# Altium schematic sheet AnchorBoard_SNS_Edison.SchDoc
size A3; Date: 10.04.2016; Author: bunto1; DrawnBy: bunto1; Organization: BFH; Address1: Berner Fachhochschule; Address2: Technik und Informatik; Address3: Höheweg 80; Address4: 2501 Biel/Bienne; DocumentNumber: 1; Revision: 1.1; SheetNumber: 2; SheetTotal: 2; CurrentDate: 10.04.2016
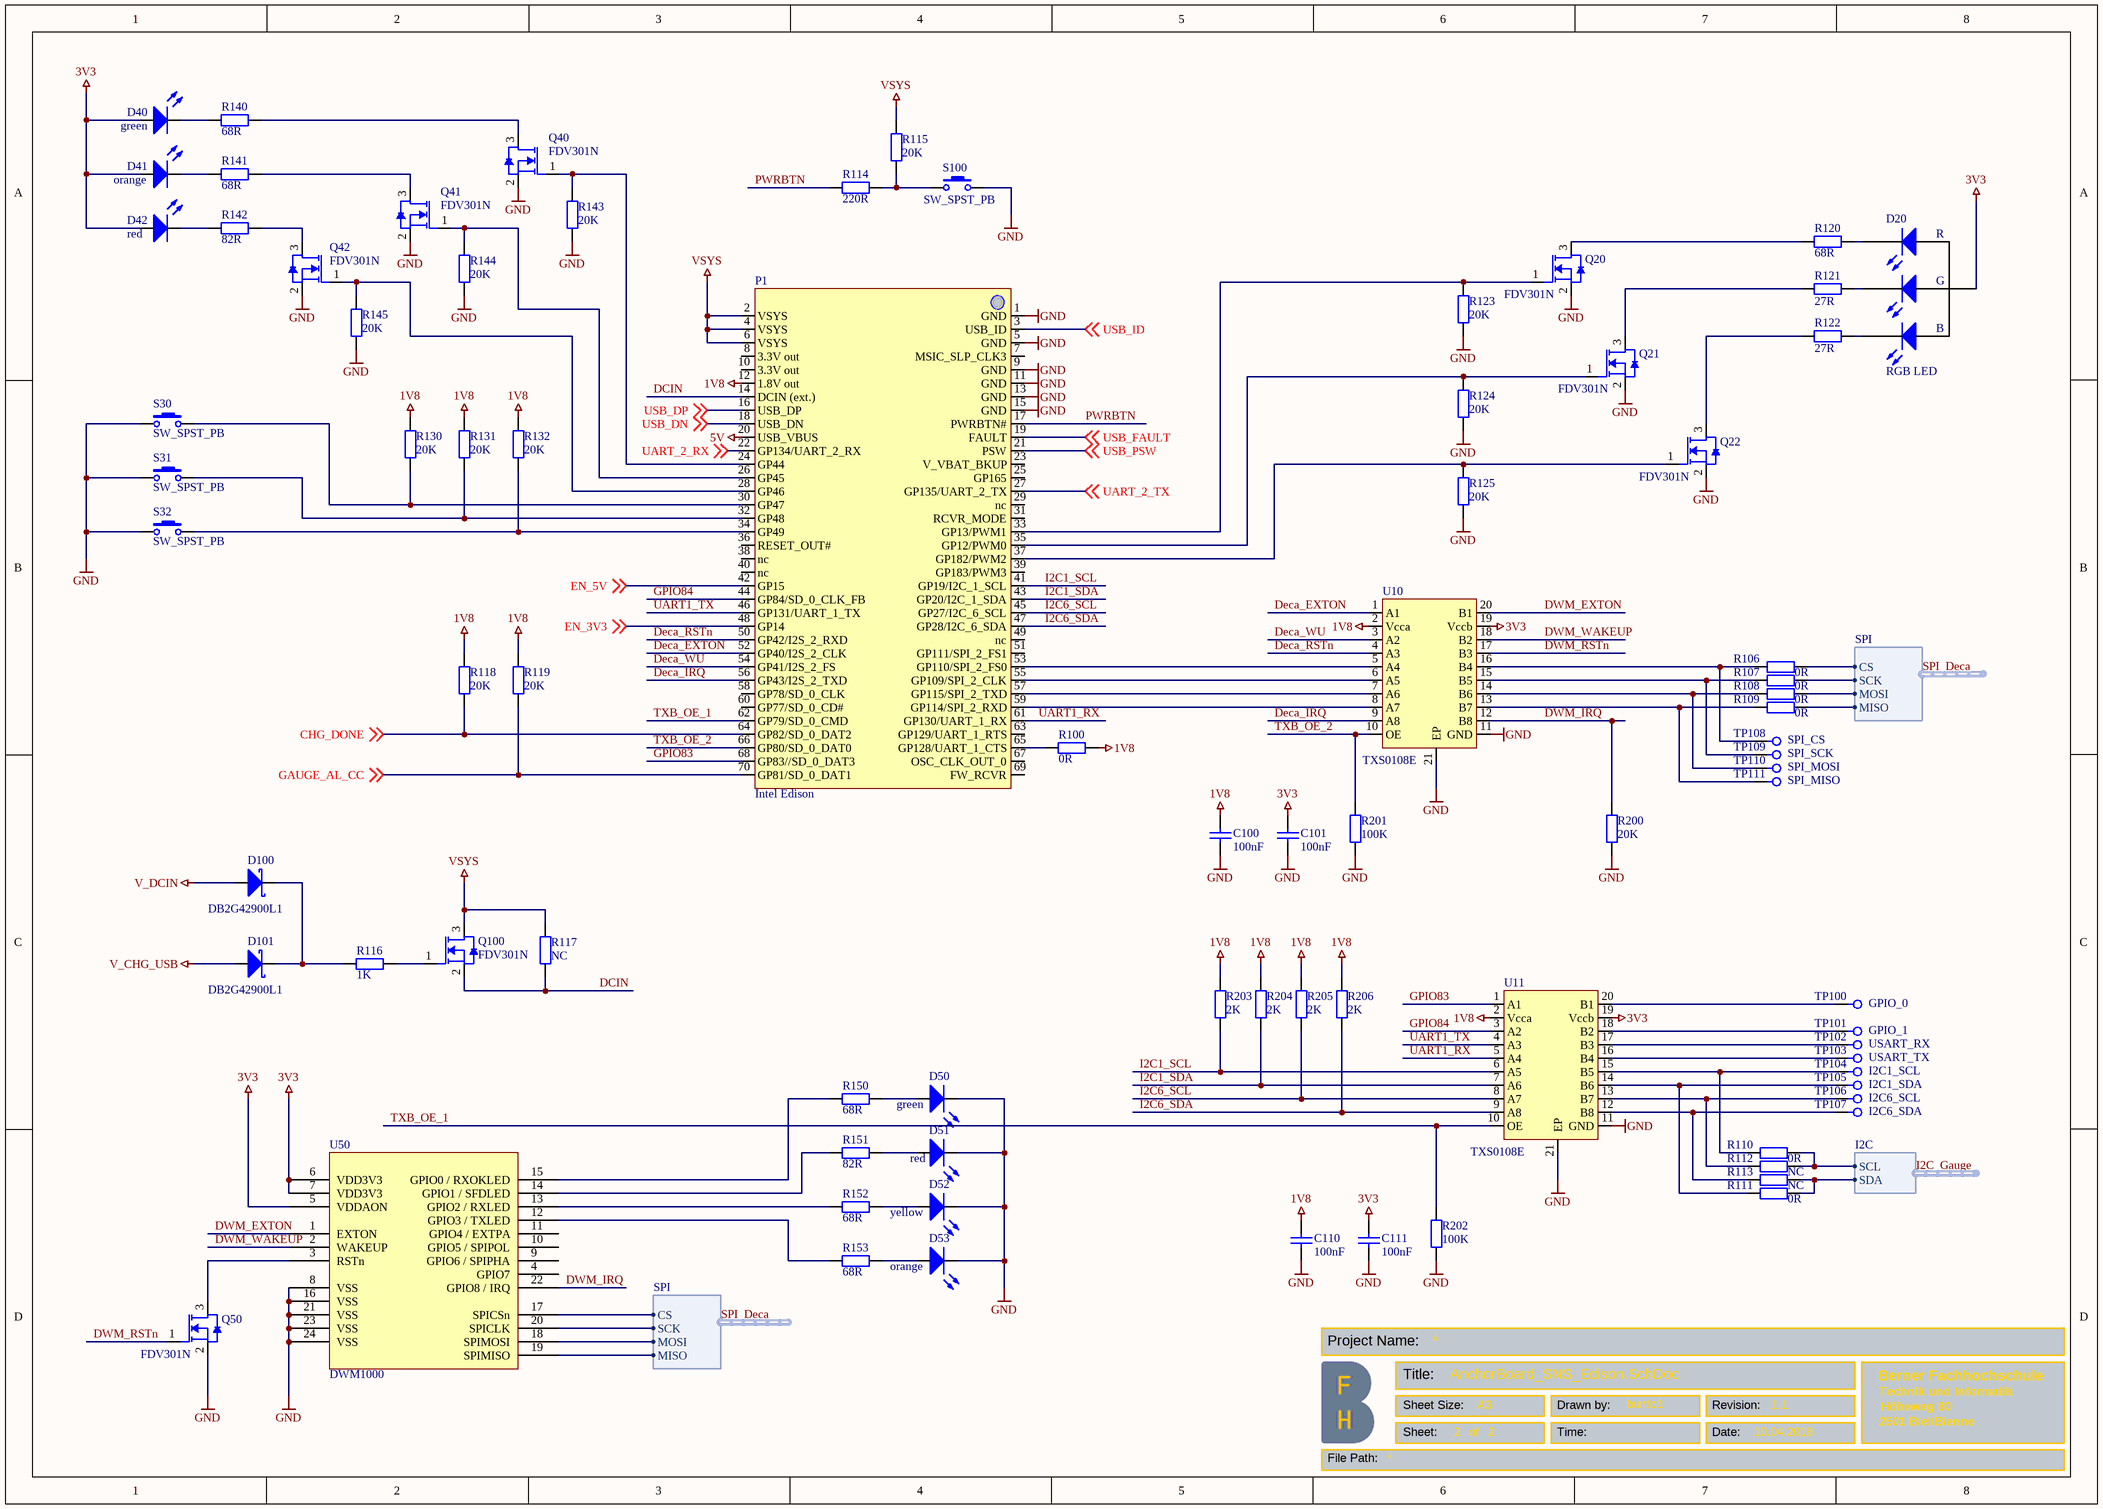
[diagram p0: AnchorBoard_SNS_Edison.SchDoc]

## Parts
C100  100nF  [CAPC1005X50]
C101  100nF  [CAPC1005X50]
C110  100nF  [CAPC1005X50]
C111  100nF  [CAPC1005X50]
D20  RGB LED  [PLCC160P350X280X190-4]
D40  green  [LEDM1608X80]
D41  orange  [LEDM1608X80]
D42  red  [LEDM1608X80]
D50  green  [LEDM1608X80]
D51  red  [LEDM1608X80]
D52  yellow  [LEDM1608X80]
D53  orange  [LEDM1608X80]
D100  DB2G42900L1  [DIOC1006X10]
D101  DB2G42900L1  [DIOC1006X10]
P1  Intel Edison  [HDRV70W12P40_2X35_Edison]
Q20  FDV301N  [SOT190P360X120-3]
Q21  FDV301N  [SOT190P360X120-3]
Q22  FDV301N  [SOT190P360X120-3]
Q40  FDV301N  [SOT190P360X120-3]
Q41  FDV301N  [SOT190P360X120-3]
Q42  FDV301N  [SOT190P360X120-3]
Q50  FDV301N  [SOT190P360X120-3]
Q100  FDV301N  [SOT190P360X120-3]
R100  0R  [RESC1005X35]
R106  0R  [RESC1005X35]
R107  0R  [RESC1005X35]
R108  0R  [RESC1005X35]
R109  0R  [RESC1005X35]
R110  0R  [RESC1005X35]
R111  0R  [RESC1005X35]
R112  NC  [RESC1005X35]
R113  NC  [RESC1005X35]
R114  220R  [RESC1005X35]
R115  20K  [RESC1005X35]
R116  1K  [RESC1005X35]
R117  NC  [RESC1005X35]
R118  20K  [RESC1005X35]
R119  20K  [RESC1005X35]
R120  68R  [RESC1005X35]
R121  27R  [RESC1005X35]
R122  27R  [RESC1005X35]
R123  20K  [RESC1005X35]
R124  20K  [RESC1005X35]
R125  20K  [RESC1005X35]
R130  20K  [RESC1005X35]
R131  20K  [RESC1005X35]
R132  20K  [RESC1005X35]
R140  68R  [RESC1005X35]
R141  68R  [RESC1005X35]
R142  82R  [RESC1005X35]
R143  20K  [RESC1005X35]
R144  20K  [RESC1005X35]
R145  20K  [RESC1005X35]
R150  68R  [RESC1005X35]
R151  82R  [RESC1005X35]
R152  68R  [RESC1005X35]
R153  68R  [RESC1005X35]
R200  20K  [RESC1005X35]
R201  100K  [RESC1005X35]
R202  100K  [RESC1005X35]
R203  2K  [RESC1005X35]
R204  2K  [RESC1005X35]
R205  2K  [RESC1005X35]
R206  2K  [RESC1005X35]
S30  SW_SPST_PB  [SW_7914J-1-000E]
S31  SW_SPST_PB  [SW_7914J-1-000E]
S32  SW_SPST_PB  [SW_7914J-1-000E]
S100  SW_SPST_PB  [SW_7914J-1-000E]
TP100  GPIO_0  [TP_THT]
TP101  GPIO_1  [TP_THT]
TP102  USART_RX  [TP_THT]
TP103  USART_TX  [TP_THT]
TP104  I2C1_SCL  [TP_THT]
TP105  I2C1_SDA  [TP_THT]
TP106  I2C6_SCL  [TP_THT]
TP107  I2C6_SDA  [TP_THT]
TP108  SPI_CS  [TP_THT]
TP109  SPI_SCK  [TP_THT]
TP110  SPI_MOSI  [TP_THT]
TP111  SPI_MISO  [TP_THT]
U10  TXS0108E  [QFN50P47X37X100-21]
U11  TXS0108E  [QFN50P47X37X100-21]
U50  DWM1000  [DECAWAVE_DWM1000]

## Harnesses
SPI: SCK, MOSI, MISO, CS
I2C: SCL, SDA

## Nets
1V8: C100.2 C110.2 P1.12(1.8V_out) R100.2 R118.1 R119.1 R130.1 R131.1 R132.1 R203.1 R204.1 R205.1 R206.1 U10.2(Vcca) U11.2(Vcca)
3V3: C101.2 C111.2 D20.2(A) D40.1(A) D41.1(A) D42.1(A) U10.19(Vccb) U11.19(Vccb) U50.5(VDDAON) U50.6(VDD3V3) U50.7(VDD3V3)
5V: P1.20(USB_VBUS)
GND: C100.1 C101.1 C110.1 C111.1 D50.2(K) D51.2(K) D52.2(K) D53.2(K) P1.1(GND) P1.5(GND) P1.9(GND) P1.11(GND) P1.13(GND) P1.15(GND) Q20.2(S) Q21.2(S) Q22.2(S) Q40.2(S) Q41.2(S) Q42.2(S) Q50.2(S) R123.2 R124.2 R125.2 R143.2 R144.2 R145.2 R200.2 R201.2 R202.2 S30.1 S31.1 S32.1 S100.2 U10.11(GND) U10.21(EP) U11.11(GND) U11.21(EP) U50.8(VSS) U50.16(VSS) U50.21(VSS) U50.23(VSS) U50.24(VSS)
V_CHG_USB: D101.2(A)
V_DCIN: D100.2(A)
VSYS: P1.2(VSYS) P1.4(VSYS) P1.6(VSYS) Q100.3(D) R115.1 R117.2
CHG_DONE: P1.64(GP82/SD_0_DAT2) R118.2 ; off-sheet CHG_DONE
DCIN: P1.14(DCIN_(ext.)) Q100.2(S) R117.1
Deca_EXTON: P1.52(GP40/I2S_2_CLK) U10.1(A1)
Deca_IRQ: P1.56(GP43/I2S_2_TXD) U10.9(A8)
Deca_RSTn: P1.50(GP42/I2S_2_RXD) U10.4(A3)
Deca_WU: P1.54(GP41/I2S_2_FS) U10.3(A2)
DWM_EXTON: U10.20(B1) U50.1(EXTON)
DWM_IRQ: R200.1 U10.12(B8) U50.22(GPIO8_/_IRQ)
DWM_RSTn: Q50.1(G) U10.17(B3)
DWM_WAKEUP: U10.18(B2) U50.2(WAKEUP)
EN_3V3: P1.48(GP14) ; off-sheet EN_3V3
EN_5V: P1.42(GP15) ; off-sheet EN_5V
GAUGE_AL_CC: P1.70(GP81/SD_0_DAT1) R119.2 ; off-sheet GAUGE_AL_CC
GPIO83: P1.68(GP83//SD_0_DAT3) U11.1(A1)
GPIO84: P1.44(GP84/SD_0_CLK_FB) U11.3(A2)
I2C1_SCL: P1.41(GP19/I2C_1_SCL) R203.2 U11.6(A5)
I2C1_SDA: P1.43(GP20/I2C_1_SDA) R204.2 U11.7(A6)
I2C6_SCL: P1.45(GP27/I2C_6_SCL) R205.2 U11.8(A7)
I2C6_SDA: P1.47(GP28/I2C_6_SDA) R206.2 U11.9(A8)
I2C_Gauge.SCL: R110.2 R112.2 ; harness I2C.SCL
I2C_Gauge.SDA: R111.2 R113.2 ; harness I2C.SDA
PWRBTN: P1.17(PWRBTN#) R114.1
SPI_Deca.CS: R106.2 U50.17(SPICSn) ; harness SPI.CS
SPI_Deca.MISO: R109.2 U50.19(SPIMISO) ; harness SPI.MISO
SPI_Deca.MOSI: R108.2 U50.18(SPIMOSI) ; harness SPI.MOSI
SPI_Deca.SCK: R107.2 U50.20(SPICLK) ; harness SPI.SCK
TXB_OE_1: P1.62(GP79/SD_0_CMD) R202.1 U11.10(OE)
TXB_OE_2: P1.66(GP80/SD_0_DAT0) R201.1 U10.10(OE)
UART1_RX: P1.61(GP130/UART_1_RX) U11.5(A4)
UART1_TX: P1.46(GP131/UART_1_TX) U11.4(A3)
UART_2_RX: P1.22(GP134/UART_2_RX) ; off-sheet UART_2_RX
UART_2_TX: P1.27(GP135/UART_2_TX) ; off-sheet UART_2_TX
USB_DN: P1.18(USB_DN) ; off-sheet USB_DN
USB_DP: P1.16(USB_DP) ; off-sheet USB_DP
USB_FAULT: P1.19(FAULT) ; off-sheet USB_FAULT
USB_ID: P1.3(USB_ID) ; off-sheet USB_ID
USB_PSW: P1.21(PSW) ; off-sheet USB_PSW
NetD20_1: D20.1(K1) R120.2
NetD20_3: D20.3(K3) R122.2
NetD20_4: D20.4(K2) R121.2
NetD40_2: D40.2(K) R140.1
NetD41_2: D41.2(K) R141.1
NetD42_2: D42.2(K) R142.1
NetD50_1: D50.1(A) R150.2
NetD51_1: D51.1(A) R151.2
NetD52_1: D52.1(A) R152.2
NetD53_1: D53.1(A) R153.2
NetD100_1: D100.1(K) D101.1(K) R116.1
NetP1_24: P1.24(GP44) Q40.1(G) R143.1
NetP1_26: P1.26(GP45) Q41.1(G) R144.1
NetP1_28: P1.28(GP46) Q42.1(G) R145.1
NetP1_30: P1.30(GP47) R130.2 S30.2
NetP1_32: P1.32(GP48) R131.2 S31.2
NetP1_33: P1.33(GP13/PWM1) Q20.1(G) R123.1
NetP1_34: P1.34(GP49) R132.2 S32.2
NetP1_35: P1.35(GP12/PWM0) Q21.1(G) R124.1
NetP1_37: P1.37(GP182/PWM2) Q22.1(G) R125.1
NetP1_53: P1.53(GP110/SPI_2_FS0) U10.5(A4)
NetP1_55: P1.55(GP109/SPI_2_CLK) U10.6(A5)
NetP1_57: P1.57(GP115/SPI_2_TXD) U10.7(A6)
NetP1_59: P1.59(GP114/SPI_2_RXD) U10.8(A7)
NetP1_65: P1.65(GP128/UART_1_CTS) R100.1
NetQ20_3: Q20.3(D) R120.1
NetQ21_3: Q21.3(D) R121.1
NetQ22_3: Q22.3(D) R122.1
NetQ40_3: Q40.3(D) R140.2
NetQ41_3: Q41.3(D) R141.2
NetQ42_3: Q42.3(D) R142.2
NetQ50_3: Q50.3(D) U50.3(RSTn)
NetQ100_1: Q100.1(G) R116.2
NetR106_1: R106.1 TP108.1(TP) U10.16(B4)
NetR107_1: R107.1 TP109.1(TP) U10.15(B5)
NetR108_1: R108.1 TP110.1(TP) U10.14(B6)
NetR109_1: R109.1 TP111.1(TP) U10.13(B7)
NetR110_1: R110.1 TP104.1(TP) U11.15(B5)
NetR111_1: R111.1 TP105.1(TP) U11.14(B6)
NetR112_1: R112.1 TP106.1(TP) U11.13(B7)
NetR113_1: R113.1 TP107.1(TP) U11.12(B8)
NetR114_2: R114.2 R115.2 S100.1
NetR150_1: R150.1 U50.15(GPIO0_/_RXOKLED)
NetR151_1: R151.1 U50.14(GPIO1_/_SFDLED)
NetR152_1: R152.1 U50.13(GPIO2_/_RXLED)
NetR153_1: R153.1 U50.12(GPIO3_/_TXLED)
NetTP100_1: TP100.1(TP) U11.20(B1)
NetTP101_1: TP101.1(TP) U11.18(B2)
NetTP102_1: TP102.1(TP) U11.17(B3)
NetTP103_1: TP103.1(TP) U11.16(B4)

Not connected (* = marked no-connect by the designer): P1 7(MSIC_SLP_CLK3) 8(3.3V_out) 10(3.3V_out) 23(V_VBAT_BKUP) 25(GP165) 29(nc) 31(RCVR_MODE) 36(RESET_OUT#) 38(nc) 39(GP183/PWM3) 40(nc) 49(nc) 51(GP111/SPI_2_FS1) 58(GP78/SD_0_CLK) 60(GP77/SD_0_CD#) 63(GP129/UART_1_RTS) 67(OSC_CLK_OUT_0) 69(FW_RCVR); U50 4(GPIO7) 9(GPIO6_/_SPIPHA) 10(GPIO5_/_SPIPOL) 11(GPIO4_/_EXTPA)

## Notes on the sheet
- Project Name:
- Title:
- File Path:
- Sheet Size:
- Sheet:
- of
- A3
- Drawn by:
- Time:
- Revision:
- Date:
- (in symbol LED_RGB_CA) R; G; B

## Library data of the parts
C100 C101 C110 C111 = Capacitor: Capacitor SMD; Manufacturer Number: GRM155R71A104KA01D; Value: 100nF; Supplier 1: Mouser; Supplier 2: Digi-Key; Supplier Part Number 1: 81-GRM155R71A104KA1D; Supplier Part Number 2: 490-6321-1-ND
D20 = LED_RGB_CA: RGB LED with common Anode; Manufacturer Number: CLVBA-FKA-CAEDH8BBB7A363; Supplier 1: Mouser; Supplier Part Number 1: 941-VBAFKACAEDH8B7A3; Supplier 2: Digi-Key; Supplier Part Number 2: CLVBA-FKA-CAEDH8BBB7A363CT-ND
D40 D50 = LED_green: Light Emitting Diode; Manufacturer Number: LTST-C190KGKT; Manufacturer: Lite-On; Forward_Current: 20mA; Modified_by: bunto1; Forward_Voltage: 2V; Modified: 15.04.2016; Color: green; Supplier 1: Mouser; Supplier Part Number 1: 859-LTST-C190KGKT; Supplier 2: Digi-Key; Supplier Part Number 2: 160-1435-1-ND
D41 D53 = LED_orange: Light Emitting Diode; Manufacturer Number: LTST-C190KFKT; Manufacturer: Lite-On; Forward_Current: 20mA; Modified_by: bunto1; Forward_Voltage: 2V; Modified: 15.04.2016; Color: orange; Supplier 1: Mouser; Supplier Part Number 1: 859-LTST-C190KFKT; Supplier 2: Digi-Key; Supplier Part Number 2: 160-1434-1-ND
D42 D51 = LED_red: Light Emitting Diode; Manufacturer Number: LTST-C190KRKT; Manufacturer: Lite-On; Forward_Current: 20mA; Modified_by: bunto1; Forward_Voltage: 2V; Modified: 15.04.2016; Color: red; Supplier 1: Mouser; Supplier Part Number 1: 859-LTST-C190KRKT; Supplier 2: Digi-Key; Supplier Part Number 2: 160-1436-1-ND
D52 = LED_yellow: Light Emitting Diode; Manufacturer Number: LTST-C190KSKT; Manufacturer: Lite-On; Forward_Current: 20mA; Modified_by: bunto1; Forward_Voltage: 2V; Modified: 15.04.2016; Color: yellow; Supplier 1: Mouser; Supplier Part Number 1: 859-LTST-C190KSKT; Supplier 2: Digi-Key; Supplier Part Number 2: 160-1437-1-ND
D100 D101 = D_SCHOTTKY: Schottky Diode; Reverse_Voltage: 40V; Manufacturer Number: DB2G42900L1; Supplier 1: Mouser; Supplier 2: Digi-Key; Supplier Part Number 1: 667-DB2G42900L1; Supplier Part Number 2: P18982CT-ND; Value: DB2G42900L1
P1 = Intel Edison Header: Intel Edison Header, 70-Pin Dual row; Manufacturer Number: DF40C-70DS-0.4V(51); Supplier 1: Mouser; Supplier Part Number 1: 798-DF40C70DS04V51; Supplier 2: Digi-Key; Supplier Part Number 2: H11631CT-ND
Q20-Q22 Q40-Q42 Q50 Q100 = FDV301N: N-Channel MOSFET; Supplier 1: Mouser; Supplier Part Number 1: 512-FDV301N; Manufacturer Number: FDV301N; Supplier 2: Digi-Key; Supplier Part Number 2: FDV301NCT-ND
R100 R106-R111 = Resistor: Manufacturer Number: ERJ-2GE0R00X; Value: 0R; Supplier 1: Mouser; Supplier 2: Digi-Key; Supplier Part Number 1: 667-ERJ-2GE0R00X; Supplier Part Number 2: P0.0JCT-ND
R112 R113 R117 = Resistor: Value: NC; Supplier 1: Mouser; Supplier 2: Digi-Key
R114 = Resistor: Manufacturer Number: ERJ-2RKF2200X; Value: 220R; Supplier 1: Mouser; Supplier 2: Digi-Key; Supplier Part Number 1: 667-ERJ-2RKF2200X; Supplier Part Number 2: P220LCT-ND
R115 R118 R119 R123-R125 R130-R132 R143-R145 R200 = Resistor: Manufacturer Number: ERJ-2RKF2002X; Value: 20K; Supplier Part Number 1: 667-ERJ-2RKF2002X; Supplier Part Number 2: P20.0KLCT-ND; Supplier 2: Digi-Key; Supplier 1: Mouser
R116 = Resistor: Manufacturer Number: ERJ-2RKF1001X; Value: 1K; Supplier 1: Mouser; Supplier 2: Digi-Key; Supplier Part Number 1: 667-ERJ-2RKF1001X; Supplier Part Number 2: P1.00KLCT-ND
R120 R140 R141 R150 R152 R153 = Resistor: Manufacturer Number: ERJ-2RKF68R0X; Value: 68R; Supplier 1: Mouser; Supplier 2: Digi-Key; Supplier Part Number 1: 667-ERJ-2RKF68R0X; Supplier Part Number 2: P68.0LCT-ND
R121 R122 = Resistor: Manufacturer Number: ERJ-2RKF27R0X; Value: 27R; Supplier 1: Mouser; Supplier 2: Digi-Key; Supplier Part Number 1: 667-ERJ-2RKF27R0X; Supplier Part Number 2: P27.0LCT-ND
R142 R151 = Resistor: Manufacturer Number: ERJ-2RKF82R0X; Value: 82R; Supplier 1: Mouser; Supplier 2: Digi-Key; Supplier Part Number 1: 667-ERJ-2RKF82R0X; Supplier Part Number 2: P82.0LCT-ND
R201 R202 = Resistor: Manufacturer Number: ERJ-2RKF1003X; Value: 100K; Supplier 2: Digi-Key; Supplier 1: Mouser; Supplier Part Number 1: 667-ERJ-2RKF1003X; Supplier Part Number 2: P100KLCT-ND
R203-R206 = Resistor: Manufacturer Number: ERJ-2RKF2001X; Value: 2K; Supplier 1: Mouser; Supplier 2: Digi-Key; Supplier Part Number 1: 667-ERJ-2RKF2001X; Supplier Part Number 2: P2.00KLCT-ND
S30-S32 S100 = SW_SPST_PB: Switch PB; Manufacturer Number: 7914J-1-000E; Supplier 1: Mouser; Supplier 2: Digi-Key; Supplier Part Number 1: 652-7914J-1-000E; Supplier Part Number 2: 7914J-000ECT-ND
TP100-TP111 = TP1: Test-Point; Values: *; Order Nbr: *; Distributor: *; Manufacturer: *; Divers: *; Price: *; Marking: *
U10 U11 = TXS0108ERGYR: 8-Bit Bidirectional Voltage-Level Translator; Supplier 2: Digi-Key; Supplier Part Number 2: 296-24806-1-ND; Supplier Part Number 1: 595-TXS0108ERGYR; Supplier 1: Mouser; Manufacturer Number: TXS0108ERGYR
U50 = DWM1000: MOD IEEE802.15.4-2011 UWB TXRX; Supplier Part Number 2: 1479-1002-1-ND; Supplier 2: Digi-Key; Manufacturer Number: DWM1000; Value: DWM1000; Supplier 1: Mouser